# EasyEDA Pro project 装甲板（击打反馈）v1.1.epro

# Schematic Schematic2
Board Name: Board2; Create Date: 2025-01-13
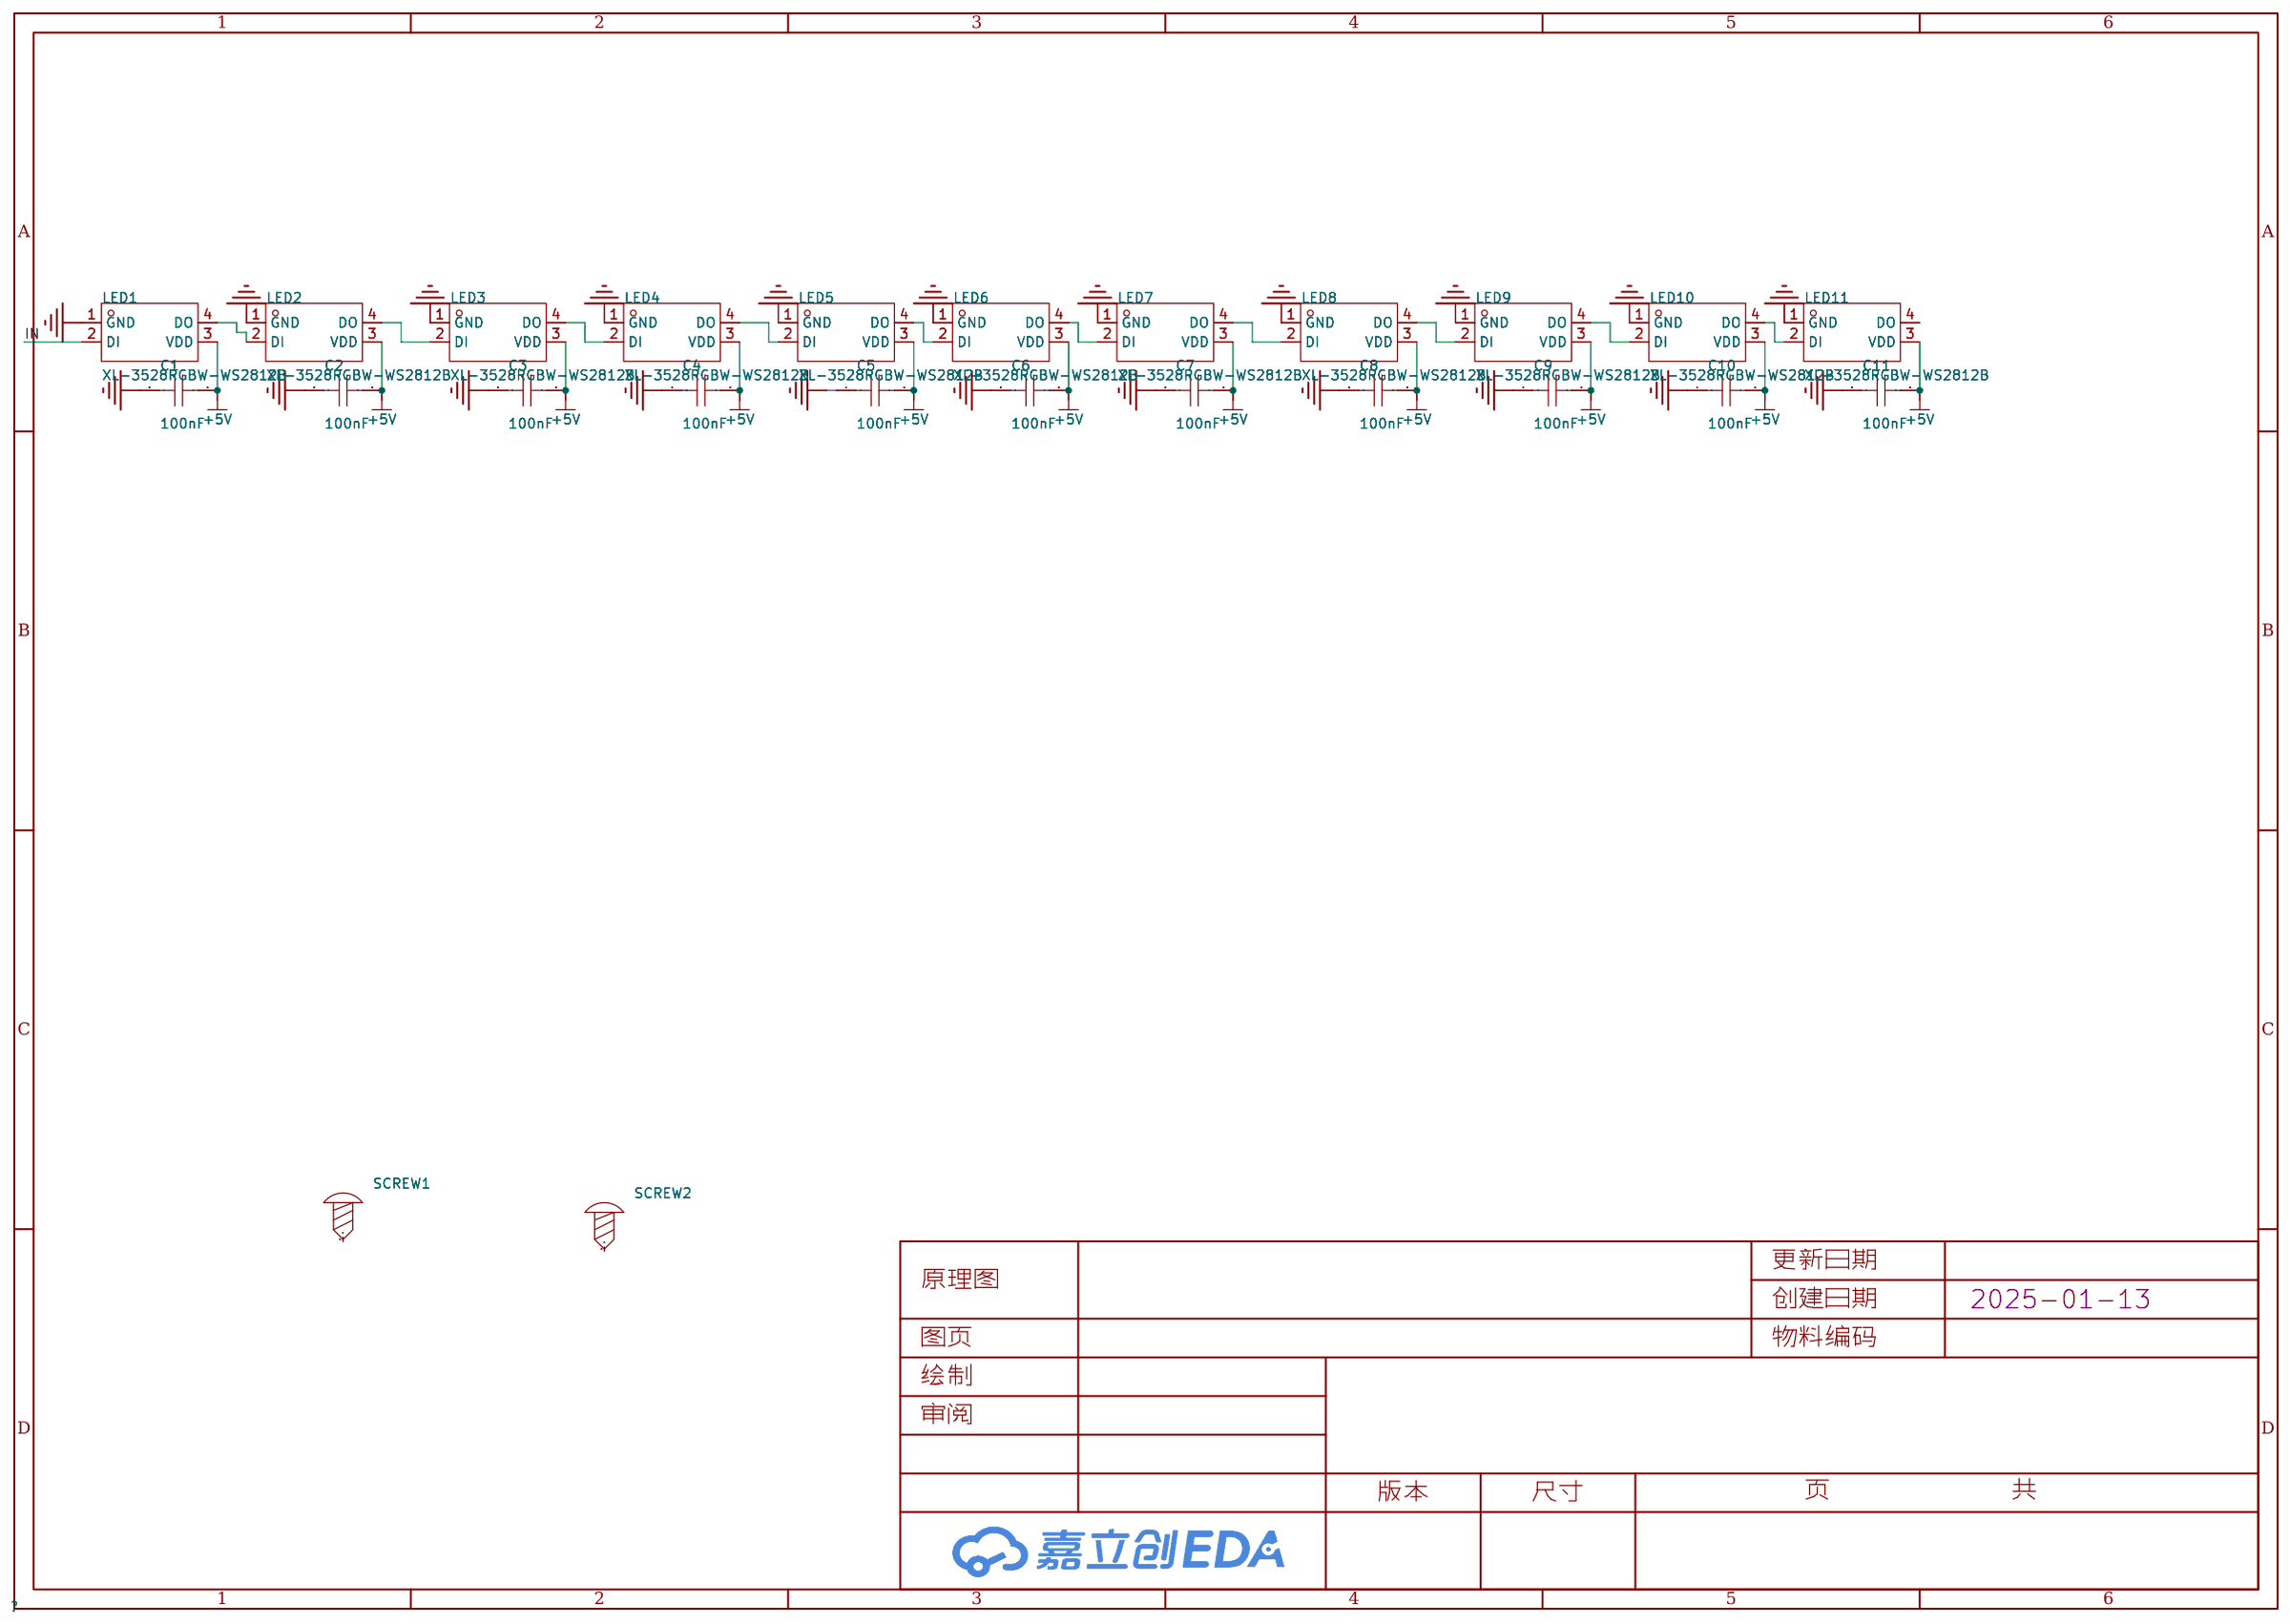
[diagram p0: schematic sheet]

## Parts
C1  100nF  [C0603]
C2  100nF  [C0603]
C3  100nF  [C0603]
C4  100nF  [C0603]
C5  100nF  [C0603]
C6  100nF  [C0603]
C7  100nF  [C0603]
C8  100nF  [C0603]
C9  100nF  [C0603]
C10  100nF  [C0603]
C11  100nF  [C0603]
LED1  XL-3528RGBW-WS2812B  [LED-SMD_4P-L3.5-W2.8-BR-1]
LED2  XL-3528RGBW-WS2812B  [LED-SMD_4P-L3.5-W2.8-BR-1]
LED3  XL-3528RGBW-WS2812B  [LED-SMD_4P-L3.5-W2.8-BR-1]
LED4  XL-3528RGBW-WS2812B  [LED-SMD_4P-L3.5-W2.8-BR-1]
LED5  XL-3528RGBW-WS2812B  [LED-SMD_4P-L3.5-W2.8-BR-1]
LED6  XL-3528RGBW-WS2812B  [LED-SMD_4P-L3.5-W2.8-BR-1]
LED7  XL-3528RGBW-WS2812B  [LED-SMD_4P-L3.5-W2.8-BR-1]
LED8  XL-3528RGBW-WS2812B  [LED-SMD_4P-L3.5-W2.8-BR-1]
LED9  XL-3528RGBW-WS2812B  [LED-SMD_4P-L3.5-W2.8-BR-1]
LED10  XL-3528RGBW-WS2812B  [LED-SMD_4P-L3.5-W2.8-BR-1]
LED11  XL-3528RGBW-WS2812B  [LED-SMD_4P-L3.5-W2.8-BR-1]
SCREW1  -  [M2螺丝]
SCREW2  -  [M2螺丝]

## Library data of the parts
C1-C11 = CAP_0603: Supplier Footprint: 0603
LED1-LED11 = XL-3528RGBW-WS2812B: 3528 七彩幻彩雾状 ws2812B 内置驱动IC; Supplier Part: C2890364; Manufacturer: XINGLIGHT(成兴光); Supplier Footprint: SMD3528-4P; JLCPCB Part Class: 扩展库; Datasheet: https://atta.szlcsc.com/upload/public/pdf/source/20240218/041E1E0D0024617DFFF124D9C311BB4D.pdf; Supplier: LCSC
SCREW1 SCREW2 = M2螺丝: Supplier Footprint: 插件

## Nets
+5V: C1.2 C2.2 C3.2 C4.2 C5.2 C6.2 C7.2 C8.2 C9.2 C10.2 C11.2 LED1.3(VDD) LED2.3(VDD) LED3.3(VDD) LED4.3(VDD) LED5.3(VDD) LED6.3(VDD) LED7.3(VDD) LED8.3(VDD) LED9.3(VDD) LED10.3(VDD) LED11.3(VDD)
GND: C1.1 C2.1 C3.1 C4.1 C5.1 C6.1 C7.1 C8.1 C9.1 C10.1 C11.1 LED1.1(GND) LED2.1(GND) LED3.1(GND) LED4.1(GND) LED5.1(GND) LED6.1(GND) LED7.1(GND) LED8.1(GND) LED9.1(GND) LED10.1(GND) LED11.1(GND)
IN: LED1.2(DI)
$1N1586: LED1.4(DO) LED2.2(DI)
$1N1594: LED2.4(DO) LED3.2(DI)
$1N1600: LED3.4(DO) LED4.2(DI)
$1N1610: LED4.4(DO) LED5.2(DI)
$1N1617: LED5.4(DO) LED6.2(DI)
$1N1624: LED6.4(DO) LED7.2(DI)
$1N1631: LED7.4(DO) LED8.2(DI)
$1N1638: LED8.4(DO) LED9.2(DI)
$1N1645: LED9.4(DO) LED10.2(DI)
$1N1652: LED10.4(DO) LED11.2(DI)

Not connected (* = marked no-connect by the designer): LED11 4(DO); SCREW1 1; SCREW2 1

# Schematic Schematic1
Board Name: Board1; Create Date: 2025-01-13
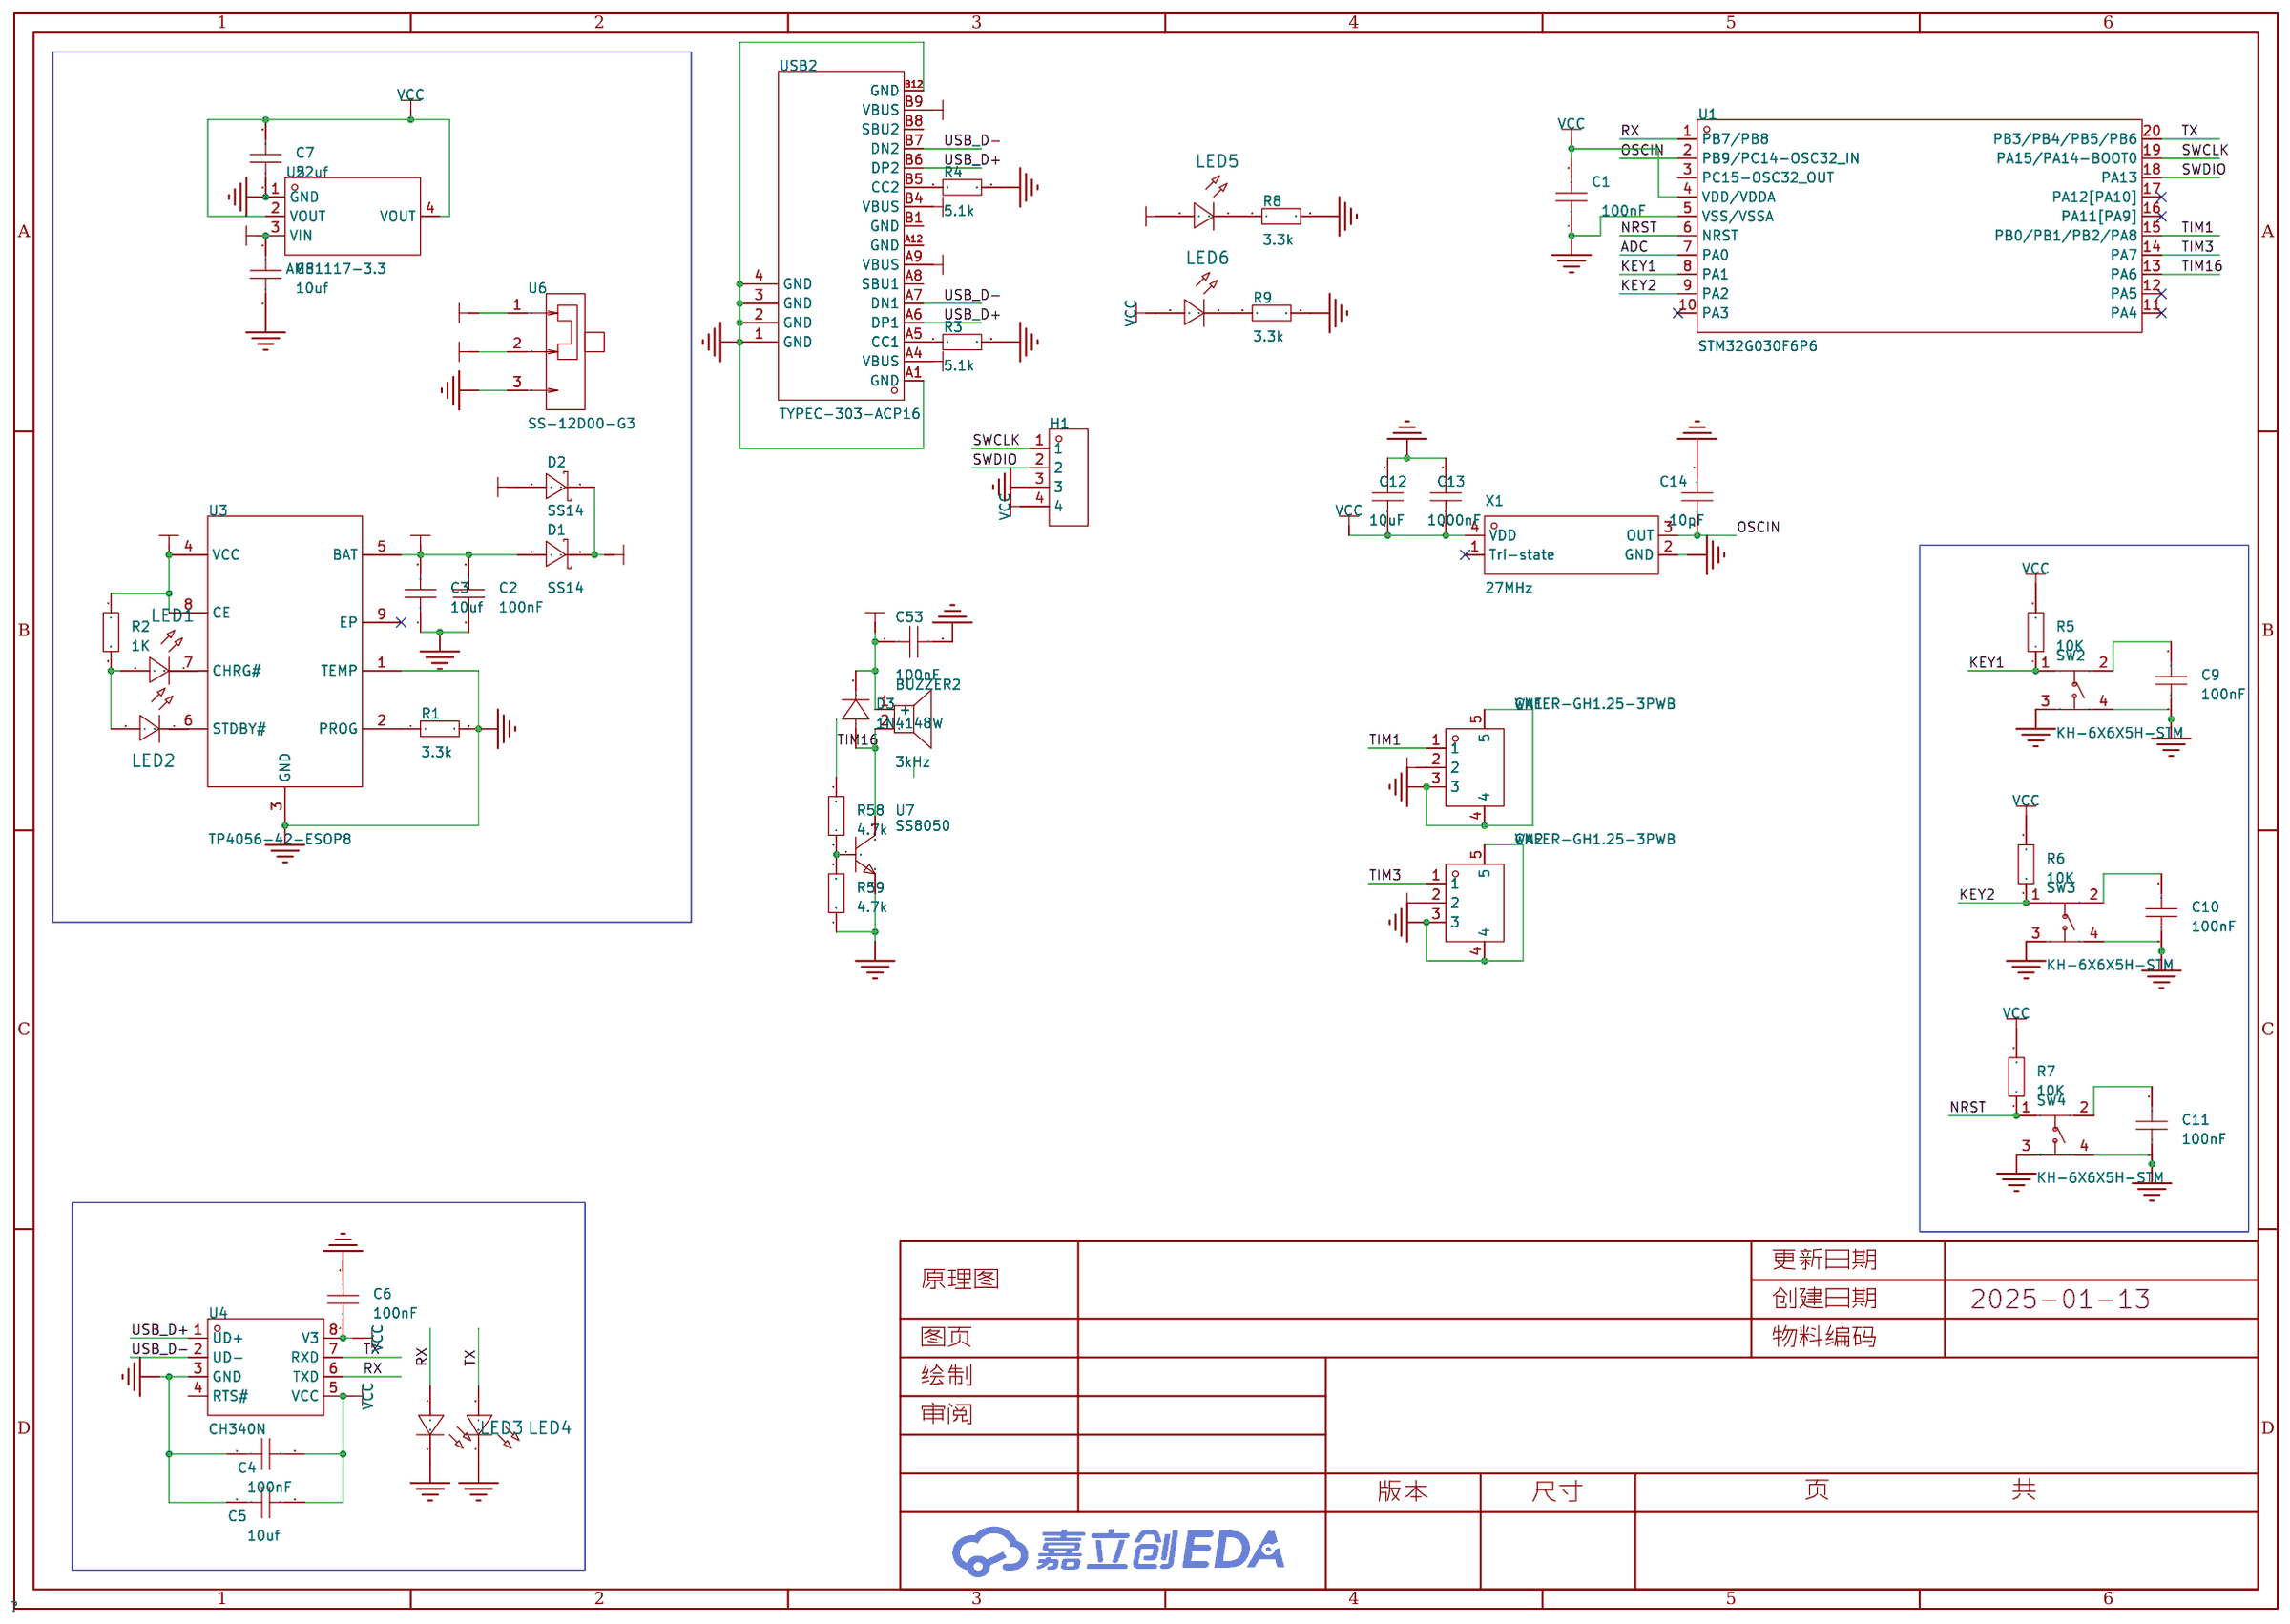
[diagram p1: schematic sheet]

## Parts
BUZZER2  3kHz  [BUZ-TH_BD9.6-P5.00-D0.7-FD]
C1  100nF  [C0603]
C2  100nF  [C0603]
C3  10uf  [C0603]
C4  100nF  [C0603]
C5  10uf  [C0603]
C6  100nF  [C0603]
C7  22uf  [C0603]
C8  10uf  [C0603]
C9  100nF  [C0603]
C10  100nF  [C0603]
C11  100nF  [C0603]
C12  10uF  [C0603]
C13  1000nF  [C0603]
C14  10pF  [C0603]
C53  100nF  [C0603]
CN1  WAFER-GH1.25-3PWB  [CONN-TH_3P-P1.25_GH1.25]
CN2  WAFER-GH1.25-3PWB  [CONN-TH_3P-P1.25_GH1.25]
D1  SS14  [SMA_L4.2-W2.6-LS5.3-RD]
D2  SS14  [SMA_L4.2-W2.6-LS5.3-RD]
D3  1N4148W  [SOD-123_L3.1-W1.7-LS3.7-RD]
H1  -  [HDR-TH_4P-P2.54-V-M]
LED1  -  [LED_0603]
LED2  -  [LED_0603]
LED3  -  [LED_0603]
LED4  -  [LED_0603]
LED5  -  [LED_0603]
LED6  -  [LED_0603]
R1  3.3k  [R0603]
R2  1K  [R0603]
R3  5.1k  [R0603]
R4  5.1k  [R0603]
R5  10K  [R0603]
R6  10K  [R0603]
R7  10K  [R0603]
R8  3.3k  [R0603]
R9  3.3k  [R0603]
R58  4.7k  [R0603]
R59  4.7k  [R0603]
SW2  KH-6X6X5H-STM  [SW-SMD_4P-L6.0-W6.0-P4.50-LS9.0-2]
SW3  KH-6X6X5H-STM  [SW-SMD_4P-L6.0-W6.0-P4.50-LS9.0-2]
SW4  KH-6X6X5H-STM  [SW-SMD_4P-L6.0-W6.0-P4.50-LS9.0-2]
U1  STM32G030F6P6  [TSSOP-20_L6.5-W4.4-P0.65-LS6.4-BL]
U3  TP4056-42-ESOP8  [ESOP-8_L4.9-W3.9-P1.27-LS6.0-BL-EP]
U4  CH340N  [SOP-8_L4.9-W3.9-P1.27-LS6.0-BL]
U5  AMS1117-3.3  [SOT-223-3_L6.5-W3.4-P2.30-LS7.0-BR]
U6  SS-12D00-G3  [SW-TH_3P-L8.8-W3.9-P2.50_SS12D00G3]
U7  SS8050  [SOT-23-3_L2.9-W1.3-P1.90-LS2.4-BR]
USB2  TYPEC-303-ACP16  [USB-C-SMD_TYPEC-303-ACP16]
X1  27MHz  [OSC-SMD_4P-L3.2-W2.5-BL]

## Library data of the parts
BUZZER2 = HNB09A05: 驱动方式:有源(内含驱动线路);构造类型:电磁式;频率:3kHz;声压(SPL):85dB;; Supplier Part: C96493; Manufacturer: 华能; Supplier Footprint: 插件,D=9mm; JLCPCB Part Class: 扩展库; Datasheet: https://atta.szlcsc.com/upload/public/pdf/source/20170522/1495448327549.pdf; Supplier: LCSC; Oscillator Circuit: 有源(内含驱动线路); Technology Type: 电磁式; Operating Voltage: 4V~8V; Sound Pressure Level (SPL): 85dB; Diameter (φD): 9mm; Height: 5.7mm
C1-C14 C53 = CAP_0603: Supplier Footprint: 0603
CN1 CN2 = WAFER-GH1.25-3PWB: 插针结构:1x3P;间距:1.25mm;安装方式:卧贴;参考系列:GH;总PIN数:3P;排数:1;每排PIN数:3;额定电流:1A;工作温度范围:-25℃~+85℃;; LCSC Part Name: 1x3P 间距:1.25mm 卧贴 系列:GH; Supplier Part: C3029378; Manufacturer: XUNPU(讯普); Supplier Footprint: SMD,P=1.25mm,卧贴; JLCPCB Part Class: 扩展库; Datasheet: https://atta.szlcsc.com/upload/public/pdf/source/20220527/CB8773BFB0913C3B8ABD62CB38BA101A.pdf; Supplier: LCSC; Pins Structure: 1x3P; Pitch: 1.25mm; Mounting Style: 卧贴; Reference Series: GH; Number of Pins: 3P; Number of Rows: 1; Number of PINs Per Row: 3; Current Rating (Max): 1A; Operating Temperature Range: -25℃~+85℃
D1 D2 = SS14_C2480: 二极管配置:独立式;正向压降(Vf):550mV@1A;直流反向耐压(Vr):40V;整流电流:1A;; LCSC Part Name: 电压:40V 电流:1A; Supplier Part: C2480; Manufacturer: MDD(辰达半导体); Supplier Footprint: SMA(DO-214AC); JLCPCB Part Class: 基础库; Datasheet: https://atta.szlcsc.com/upload/public/pdf/source/20230712/2DB6064CFBB99DE6DB116BEE8208BE66.pdf; Supplier: LCSC; Diode Configuration: 独立式; Forward Voltage (Vf@If): 550mV@1A; Reverse Voltage (Vr): 40V; Rectified Current: 1A; Reverse Leakage Current (Ir): 300uA@40V
D3 = 1N4148W_C727110: 二极管配置:独立式;正向压降(Vf):1.5V@300mA;直流反向耐压(Vr):100V;平均整流电流(Io):300mA;功率:400mW;反向恢复时间(trr):8ns;; LCSC Part Name: 电压:100V 电流:300mA; Supplier Part: C727110; Manufacturer: TWGMC(台湾迪嘉); Supplier Footprint: SOD-123; JLCPCB Part Class: Extended Part; Datasheet: https://atta.szlcsc.com/upload/public/pdf/source/20200828/C727110_99AC3443E5714B605FD2E8FDF6DB8A39.pdf; Supplier: LCSC; Diode Configuration: 独立式; Forward Voltage (Vf@If): 1.5V@300mA; Reverse Voltage (Vr): 100V; Average Rectified Current (Io): 300mA; Power Dissipation: 400mW; Reverse Leakage Current: 1uA@75V; Reverse Recovery Time (trr): 8ns; Operating Temperature: -55℃~+150℃@(Tj)
H1 = HDR-M_2.54_1x4P: Supplier Part: C492403; Supplier Footprint: 插件
LED1-LED6 = LED_0603-R: Supplier Footprint: 0603
R1-R9 R58 R59 = Res_0603: Supplier Footprint: 0603
SW2-SW4 = KH-6X6X5H-STM: 电路结构:单刀单掷;按钮形状:圆形按钮;安装方式:立贴;开关长度:6mm;开关宽度:6mm;开关高度:5mm;带支架:不带;触点电流:50mA;额定电压(DC):12V;机械寿命:8万次;; LCSC Part Name: 6*6*5mm 立贴 轻触开关; Supplier Part: C2837531; Manufacturer: kinghelm(金航标); Supplier Footprint: SMD; JLCPCB Part Class: 扩展库; Datasheet: https://atta.szlcsc.com/upload/public/pdf/source/20210608/C2837531_45E87AB996CE723B09405FF2EA209C4C.pdf; Supplier: LCSC; Circuit: 单刀单掷; Actuator Style: 圆形按钮; Mounting Style: 立贴; Switch Length: 6mm; Switch Width: 6mm; Switch Height: 5mm; Strike Gundam: 不带; Contact Current: 50mA; Voltage Rating (DC): 12V; Actuator/Cap Color: 黑色; Pin Style: 鸥翼型; Mechanical Life: 8万次
U1 = STM32G030F6P6: CPU内核:ARM-M0;CPU最大主频:64MHz;应用领域:-;; LCSC Part Name: 主流超值系列Arm Cortex-M0+ MCU，具有32 KB Flash存储器、8 KB RAM、64 MHz CPU、2x USART、定时器、ADC和通信接口，2-3.6V; Supplier Part: C724040; Manufacturer: ST(意法半导体); Supplier Footprint: TSSOP-20; JLCPCB Part Class: 扩展库; Datasheet: https://atta.szlcsc.com/upload/public/pdf/source/20200511/C529329_A1CB615556C746C4EA827FCAD1461480.pdf; Supplier: LCSC; CPU Core: ARM-M0; CPU Maximum Speed: 64MHz; Program Storage Size: 32KB; Program Memory Type: FLASH; Number of I/O: 18; ADC (Bit): 12bit; Low Voltage Detection Threshold: 2V~3.6V
U3 = TP4056-42-ESOP8: 锂电池充电芯片 42代表电池满电电压4.2V。; Supplier Part: C16581; Manufacturer: TOPPOWER(南京拓微); Supplier Footprint: ESOP-8; JLCPCB Part Class: 扩展库; Datasheet: https://atta.szlcsc.com/upload/public/pdf/source/20190626/C16581_611BCF5D7CF554EAE465137A8F68DB3E.pdf; Supplier: LCSC
U4 = CH340N: 应用功能:USB转串口;接口协议:USB 2.0;通道数:1;数据速率:2Mbps;; LCSC Part Name: USB转串口芯片CH340; Supplier Part: C2977777; Manufacturer: WCH(南京沁恒); Supplier Footprint: SOP-8; JLCPCB Part Class: 扩展库; Datasheet: https://atta.szlcsc.com/upload/public/pdf/source/20240313/115CDE92081B1D6CB446704AD5D0F5F2.pdf; Supplier: LCSC; Applications Function: USB转串口; Protocol: USB 2.0; Number of Channels: 1; Supply Voltage: 3.3V；5V; Data Rate: 2Mbps; Operating Temperature: -20℃~+70℃
U5 = AMS1117-3.3_C6186: 输出类型:固定;最大输入电压:-;输出电压:3.3V;最大输出电流:1A;电源纹波抑制比(PSRR):72dB@(120Hz);输出极性:正极;; LCSC Part Name: 输出3.3V 1A; Supplier Part: C6186; Manufacturer: AMS; Supplier Footprint: SOT-223; JLCPCB Part Class: 基础库; Datasheet: https://atta.szlcsc.com/upload/public/pdf/source/20180727/C6186_7A095716F0823C02F1997A905E26C086.pdf; Supplier: LCSC; Output Type: 固定; Output Voltage: 3.3V; MAX Output Current: 1A; Power Supply Rejection Ratio (PSRR): 72dB@(120Hz); Dropout Voltage: 1.3V@(800mA); Output Polarity: 正极; Number of Outputs: 1
U6 = SS-12D00-G3: 操作正拨 插件立式 尺寸大型 两档位; Supplier Part: C22355741; Manufacturer: SOFNG(硕方); Supplier Footprint: 插件-3P,8.8x3.9mm; JLCPCB Part Class: 扩展库; Datasheet: https://atta.szlcsc.com/upload/public/pdf/source/20240529/1037A069FE9BBCECE56007AB916D4384.pdf; Supplier: LCSC
U7 = SS8050_C7420370: 晶体管类型:NPN;集电极电流(Ic):1.5A;集射极击穿电压(Vceo):25V;功率(Pd):300mW;直流电流增益(hFE@Ic,Vce):120@100mA,1.0V;; LCSC Part Name: 耐压:25V 电流:1.5A NPN H档 200-350; Supplier Part: C7420370; Manufacturer: 宏迦橙; Supplier Footprint: SOT-23; JLCPCB Part Class: 扩展库; Datasheet: https://atta.szlcsc.com/upload/public/pdf/source/20231222/9C4050A7669EB24B3ACD0418218817FD.pdf; Supplier: LCSC; Transistor Type: NPN; Collector Current (Ic): 1.5A; Collector-Emitter Breakdown Voltage (Vceo): 25V; Power Dissipation (Pd): 300mW; DC Current Gain (hFE@Ic,Vce): 120@100mA,1.0V; Transition Frequency (fT): 100MHz; Collector Cut-Off Current (Icbo): 100nA; Collector-Emitter Saturation Voltage (VCE(sat)@Ic,Ib): 500mV@800mA,80mA; Operating Temperature: -55℃~+150℃
USB2 = TYPEC-303-ACP16: 连接器类型:Type-C;标准:USB 3.1;公母:母;端口数量:1;触点数量:16P;安装方式:立贴;额定电流 - 电源:5A;工作温度范围:-25℃~+85℃;焊接温度(最大值):260℃;; LCSC Part Name: Type-C 母 立贴; Supplier Part: C720628; Manufacturer: XUNPU(讯普); Supplier Footprint: SMD; JLCPCB Part Class: 扩展库; Datasheet: https://atta.szlcsc.com/upload/public/pdf/source/20211130/923863AA03137020414D5B2211B6B11A.pdf; Supplier: LCSC; Connector Type: Type-C; Standard: USB 3.1; Gender: 母; Number of Ports: 1; Number of Contacts: 16P; Mounting Style: 立贴; Current Rating - Power (Max): 5A; Operating Temperature Range: -25℃~+85℃; Soldering Temperature(Max): 260℃
X1 = OT2EL4C4JI-111OLP-27M: 频率:27MHz;常温频差:±10ppm;输出模式:CMOS;工作电压:1.8V~3.3V;; LCSC Part Name: 27MHZ 1.8V-3.3V ±10PPM YSO110TR; Supplier Part: C5203549; Manufacturer: YXC(扬兴晶振); Supplier Footprint: SMD3225-4P; JLCPCB Part Class: 扩展库; Datasheet: https://atta.szlcsc.com/upload/public/pdf/source/20221021/93BE0275F36E6561B802C10A6737F13A.pdf; Supplier: LCSC; Normal temperature Frequency Tolerance: ±10ppm; Output Type: CMOS; Supply Voltage: 1.8V~3.3V; Operating Temperature: -40℃~+85℃

## Nets
GND: C1.1 C2.1 C3.1 C4.1 C5.1 C6.2 C7.1 C8.1 C9.1 C10.1 C11.1 C12.2 C13.2 C14.2 C53.2 CN1.3 CN1.4 CN1.5 CN2.3 CN2.4 CN2.5 H1.3 LED3.1(C) LED4.1(C) R1.2 R3.2 R4.2 R8.2 R9.2 R59.1 SW2.3 SW2.4 SW3.3 SW3.4 SW4.3 SW4.4 U1.5(VSS/VSSA) U3.1(TEMP) U3.3(GND) U4.3(GND) U5.1(GND) U6.3 U7.2(E) USB2.1(GND) USB2.2(GND) USB2.3(GND) USB2.4(GND) USB2.A1(GND) USB2.B12(GND) X1.2(GND)
VBUS: BUZZER2.1(+) C53.1 CN1.2 CN2.2 D2.2(A) D3.1(K) LED5.2(A) R2.1 U3.4(VCC) U3.8(CE) USB2.A4(VBUS) USB2.A9(VBUS) USB2.B4(VBUS) USB2.B9(VBUS)
VCC: C1.2 C4.2 C5.2 C6.1 C7.2 C12.1 C13.1 H1.4 LED6.2(A) R5.2 R6.2 R7.2 U1.4(VDD/VDDA) U4.5(VCC) U4.8(V3) U5.2(VOUT) U5.4(VOUT) X1.4(VDD)
VIN: C8.2 U5.3(VIN) U6.2
ADC: U1.7(PA0)
BAT: C2.2 C3.2 D1.2(A) U3.5(BAT)
KEY1: R5.1 SW2.1 U1.8(PA1)
KEY2: R6.1 SW3.1 U1.9(PA2)
NRST: R7.1 SW4.1 U1.6(NRST)
OSCIN: C14.1 U1.2(PB9/PC14-OSC32_IN) X1.3(OUT)
RX: LED3.2(A) U1.1(PB7/PB8) U4.6(TXD)
SWCLK: H1.1 U1.19(PA15/PA14-BOOT0)
SWDIO: H1.2 U1.18(PA13)
TIM1: CN1.1 U1.15(PB0/PB1/PB2/PA8)
TIM3: CN2.1 U1.14(PA7)
TIM16: R58.2 U1.13(PA6)
TX: LED4.2(A) U1.20(PB3/PB4/PB5/PB6) U4.7(RXD)
USB_D+: U4.1(UD+) USB2.A6(DP1) USB2.B6(DP2)
USB_D-: U4.2(UD-) USB2.A7(DN1) USB2.B7(DN2)
VOUT: D1.1(K) D2.1(K) U6.1
$1N907: R1.1 U3.2(PROG)
$1N910: LED1.2(A) LED2.2(A) R2.2
$1N911: LED1.1(C) U3.7(CHRG#)
$1N912: LED2.1(C) U3.6(STDBY#)
$1N1730: R3.1 USB2.A5(CC1)
$1N1756: R4.1 USB2.B5(CC2)
$1N2680: C9.2 SW2.2
$1N2872: C10.2 SW3.2
$1N3022: C11.2 SW4.2
$1N3734: LED5.1(C) R8.1
$1N3739: LED6.1(C) R9.1
$1N5447: R58.1 R59.2 U7.1(B)
$1N5448: BUZZER2.2 D3.2(A) U7.3(C)

Not connected (* = marked no-connect by the designer): U1 3(PC15-OSC32_OUT) 10(PA3)* 11(PA4)* 12(PA5)* 16(PA11[PA9])* 17(PA12[PA10])*; U3 9(EP)*; U4 4(RTS#); USB2 A8(SBU1) A12(GND) B1(GND) B8(SBU2); X1 1(Tri-state)*

# Board PCB2
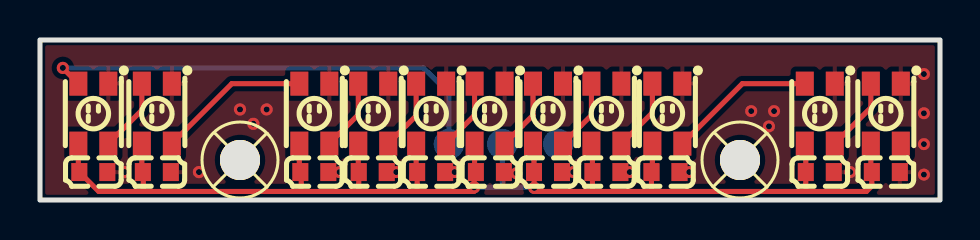
[diagram p2: board, top side]
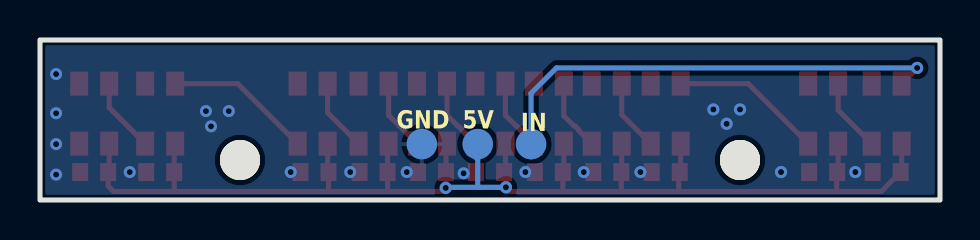
[diagram p3: board, bottom side, seen from below]

Outline 45 x 8 mm; copper layers: Top Layer, Bottom Layer. Coordinates in mm from the lower left corner of the outline.
Outline path: rectangle 0,8 45,0
Stack: Top Layer 0.035mm / Dielectric1 1.51mm FR4 er 4.5 / Bottom Layer 0.035mm

## Design rules (mm)
template: 自定义配置
spacing copperThickness1oz (default): track to track 0.102, other pairs 0.152 to 0.3
spacing copperThickness2oz: track to track 0.203, other pairs 0.152 to 0.3
track width copperThickness1oz (default): min 0.127, default 0.254, max 2.54
track width copperThickness2oz: min 0.203, default 0.254, max 2.54
differential pair differentialPair (default): width min 0.127, default 0.254, max 2.54; gap min 0.152, default 0.152
via viaSize (default): diameter min 0.5, default 0.6, max 10; hole min 0.3, default 0.3, max 6.3

## Placement (name value [footprint] x y rotation side)
C1  100nF  [C0603]  2.67 1.4 180 top
C2  100nF  [C0603]  5.84 1.4 180 top
C3  100nF  [C0603]  13.72 1.4 180 top
C4  100nF  [C0603]  16.64 1.4 180 top
C5  100nF  [C0603]  19.56 1.4 180 top
C6  100nF  [C0603]  22.5 1.4 180 top
C7  100nF  [C0603]  28.32 1.4 180 top
C8  100nF  [C0603]  25.4 1.4 180 top
C9  100nF  [C0603]  31.27 1.4 180 top
C10  100nF  [C0603]  38.99 1.4 180 top
C11  100nF  [C0603]  42.29 1.4 180 top
LED1  XL-3528RGBW-WS2812B  [LED-SMD_4P-L3.5-W2.8-BR-1]  2.67 4.32 90 top
LED2  XL-3528RGBW-WS2812B  [LED-SMD_4P-L3.5-W2.8-BR-1]  5.84 4.32 90 top
LED3  XL-3528RGBW-WS2812B  [LED-SMD_4P-L3.5-W2.8-BR-1]  13.72 4.32 90 top
LED4  XL-3528RGBW-WS2812B  [LED-SMD_4P-L3.5-W2.8-BR-1]  16.66 4.32 90 top
LED5  XL-3528RGBW-WS2812B  [LED-SMD_4P-L3.5-W2.8-BR-1]  19.56 4.32 90 top
LED6  XL-3528RGBW-WS2812B  [LED-SMD_4P-L3.5-W2.8-BR-1]  22.48 4.32 90 top
LED7  XL-3528RGBW-WS2812B  [LED-SMD_4P-L3.5-W2.8-BR-1]  25.4 4.32 90 top
LED8  XL-3528RGBW-WS2812B  [LED-SMD_4P-L3.5-W2.8-BR-1]  28.32 4.32 90 top
LED9  XL-3528RGBW-WS2812B  [LED-SMD_4P-L3.5-W2.8-BR-1]  31.37 4.32 90 top
LED10  XL-3528RGBW-WS2812B  [LED-SMD_4P-L3.5-W2.8-BR-1]  38.99 4.32 90 top
LED11  XL-3528RGBW-WS2812B  [LED-SMD_4P-L3.5-W2.8-BR-1]  42.29 4.32 90 top
NOREF  -  [Pad_e26]  20.45 2.79 180 top
NOREF#2  -  [Pad_e1]  23.11 2.79 180 top
NOREF#3  -  [Pad_e27]  25.91 2.79 180 top
SCREW1  -  [M2螺丝]  10 2 0 top
SCREW2  -  [M2螺丝]  35 2 0 top

## Footprints (pads in the part's own frame, mm; a bottom-side part is the same pattern mirrored in y, then rotated)
C0603
  rect 0.8x0.9 smd: 1(-0.7,0) 2(0.7,0)
LED-SMD_4P-L3.5-W2.8-BR-1
  rect 1.2x0.9 smd: 1(1.5,-0.75) 2(1.5,0.75) 3(-1.5,0.75) 4(-1.5,-0.75)
M2螺丝
  round 2 hole 2: 1(0,0)
Pad_e1
  round 1.524 smd far side: 1(0,0)
Pad_e26
  round 1.524 smd far side: 2(0,0)
Pad_e27
  round 1.524 smd far side: 3(0,0)

## Nets
+5V: C1.2 C2.2 C3.2 C4.2 C5.2 C6.2 C7.2 C8.2 C9.2 C10.2 C11.2 LED1.3 LED2.3 LED3.3 LED4.3 LED5.3 LED6.3 LED7.3 LED8.3 LED9.3 LED10.3 LED11.3 NOREF#2.1
GND: C1.1 C2.1 C3.1 C4.1 C5.1 C6.1 C7.1 C8.1 C9.1 C10.1 C11.1 LED1.1 LED2.1 LED3.1 LED4.1 LED5.1 LED6.1 LED7.1 LED8.1 LED9.1 LED10.1 LED11.1 NOREF#3.3
IN: LED1.2 NOREF.2
$1N1586: LED1.4 LED2.2
$1N1594: LED2.4 LED3.2
$1N1600: LED3.4 LED4.2
$1N1610: LED4.4 LED5.2
$1N1617: LED5.4 LED6.2
$1N1624: LED6.4 LED7.2
$1N1631: LED7.4 LED8.2
$1N1638: LED8.4 LED9.2
$1N1645: LED9.4 LED10.2
$1N1652: LED10.4 LED11.2

Pads without a net: LED11 4; SCREW1 1; SCREW2 1

## Via types
v1: diameter 0.61, hole 0.305, Top Layer to Bottom Layer, 8 vias
v2: diameter 0.6, hole 0.3, Top Layer to Bottom Layer, 15 vias

## Routing (per net, layer and track width the routed paths; a pad name or vN(x,y) marks a point on that pad's centre or on a via; arc(x,y) is an arc through that point)
+5V: length 66.9
  Top Layer w0.254: 5.16,0.43 2.94,0.43 C1.2 1.92,1.45 LED1.3 ; 5.16,0.43 13.06,0.43 ; 5.16,0.43 5.16,1.37 C2.2 5.09,1.45 LED2.3 ; LED5.3 18.81,1.45 C5.2 18.86,0.48 18.81,0.43 ; 27.67,0.43 24.71,0.43 24.71,1.39 C8.2 24.7,2.77 LED7.3 ; 27.67,0.43 27.62,0.48 C7.2 27.62,2.77 LED8.3 ; 27.67,0.43 30.5,0.43 ; C9.2 30.57,0.5 30.5,0.43 ; 13.06,0.43 15.85,0.43 ; 13.06,0.43 13.06,1.35 C3.2 12.97,1.45 LED3.3 ; 15.85,0.43 15.94,0.51 C4.2 15.91,1.42 LED4.3 ; 15.85,0.43 18.81,0.43 ; LED10.3 38.29,2.77 38.29,0.46 38.32,0.43 ; 30.5,0.43 38.32,0.43 ; LED11.3 41.54,1.45 C11.2 41.59,0.7 41.32,0.43 38.32,0.43 ; LED9.3 30.62,1.57 ; 18.81,0.43 21.71,0.43 ; 30.51,1.46 30.45,1.4 ; v1(21.71,0.64) 21.71,1.31 C6.2 21.73,1.46 LED6.3
  Bottom Layer w0.254: 23.11,0.64 23.11,2.03 23.24,2.16 ; 23.11,0.64 24.69,0.64 v1(24.72,0.61) ; 23.11,0.64 v1(21.71,0.64)
GND:
  vias: v1(4.23,1.4) v1(7.95,1.4) v1(10,4.53) v1(10.67,3.81) v1(11.33,4.53) v2(14.98,1.4) v2(17.81,1.4) v2(20.73,1.4) v2(23.82,1.34) v2(26.66,1.4) v2(29.49,1.4) v2(32.47,1.4) v2(35.56,4.44) v2(36.45,3.68) v2(36.7,4.44) v2(40.51,1.4) v2(44.2,6.3) v2(44.2,4.34) v2(44.2,2.79) v2(44.2,1.27)
IN: length 24.1
  Top Layer w0.254: LED1.2 1.14,6.59 v1(1.14,6.6)
  Bottom Layer w0.254: v1(1.14,6.6) 19.18,6.6 20.45,5.33 NOREF.2 20.45,2.16
$1N1586: length 3.7
  Top Layer w0.254: LED1.4 5.09,4.49 LED2.2
$1N1594: length 7.6
  Top Layer w0.254: LED3.2 9.59,5.82 LED2.4
$1N1600: length 3.6
  Top Layer w0.254: LED4.2 15.91,4.27 LED3.4
$1N1610: length 3.6
  Top Layer w0.254: LED4.4 18.08,3.48 18.08,3.53 18.24,3.7 18.29,3.7 18.81,4.21 LED5.2
$1N1617: length 3.6
  Top Layer w0.254: LED5.4 21,3.51 21,3.53 21.16,3.7 21.19,3.7 21.73,4.24 LED6.2
$1N1624: length 3.6
  Top Layer w0.254: LED6.4 23.92,3.51 23.92,3.53 24.08,3.7 24.11,3.7 24.65,4.24 LED7.2
$1N1631: length 3.6
  Top Layer w0.254: LED8.2 27.57,4.24 27.03,3.7 27.01,3.7 26.84,3.53 26.84,3.51 LED7.4
$1N1638: length 3.6
  Top Layer w0.254: LED8.4 30.62,4.37 LED9.2
$1N1645: length 7.4
  Top Layer w0.254: LED10.2 35.12,5.82 LED9.4
$1N1652: length 3.7
  Top Layer w0.254: LED10.4 41.54,4.62 LED11.2

## Copper pours and planes (outline as drawn; the poured copper is in the pictures)
GND on Top Layer: -4.32,10.41 50.8,10.41 50.8,-0.89 -4.32,-0.89
GND on Bottom Layer: -1.52,10.03 47.37,10.03 47.37,-3.94 -1.52,-3.94

## Text on the board
Bottom Silkscreen Layer: IN | 5V | GND

# Board PCB1
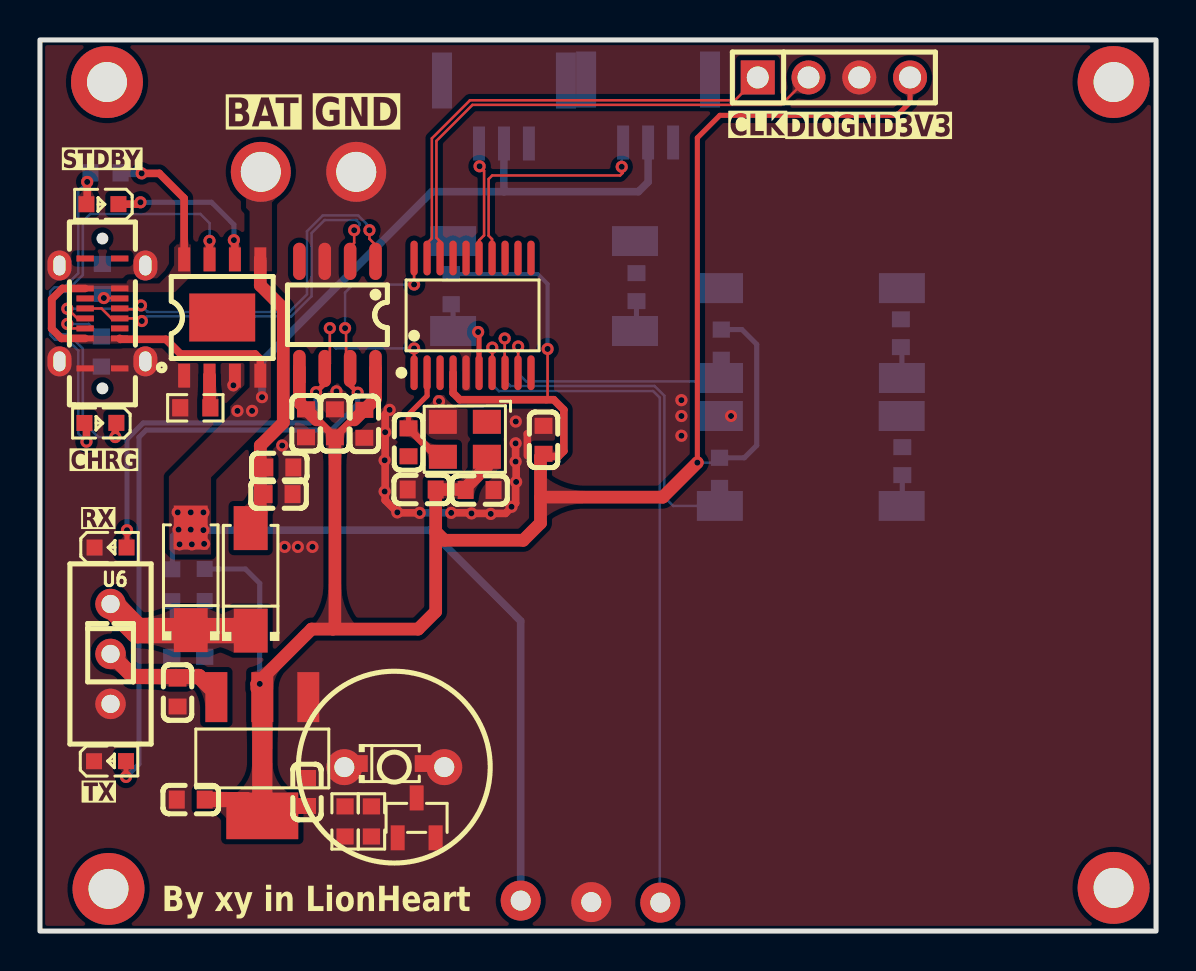
[diagram p4: board, top side]
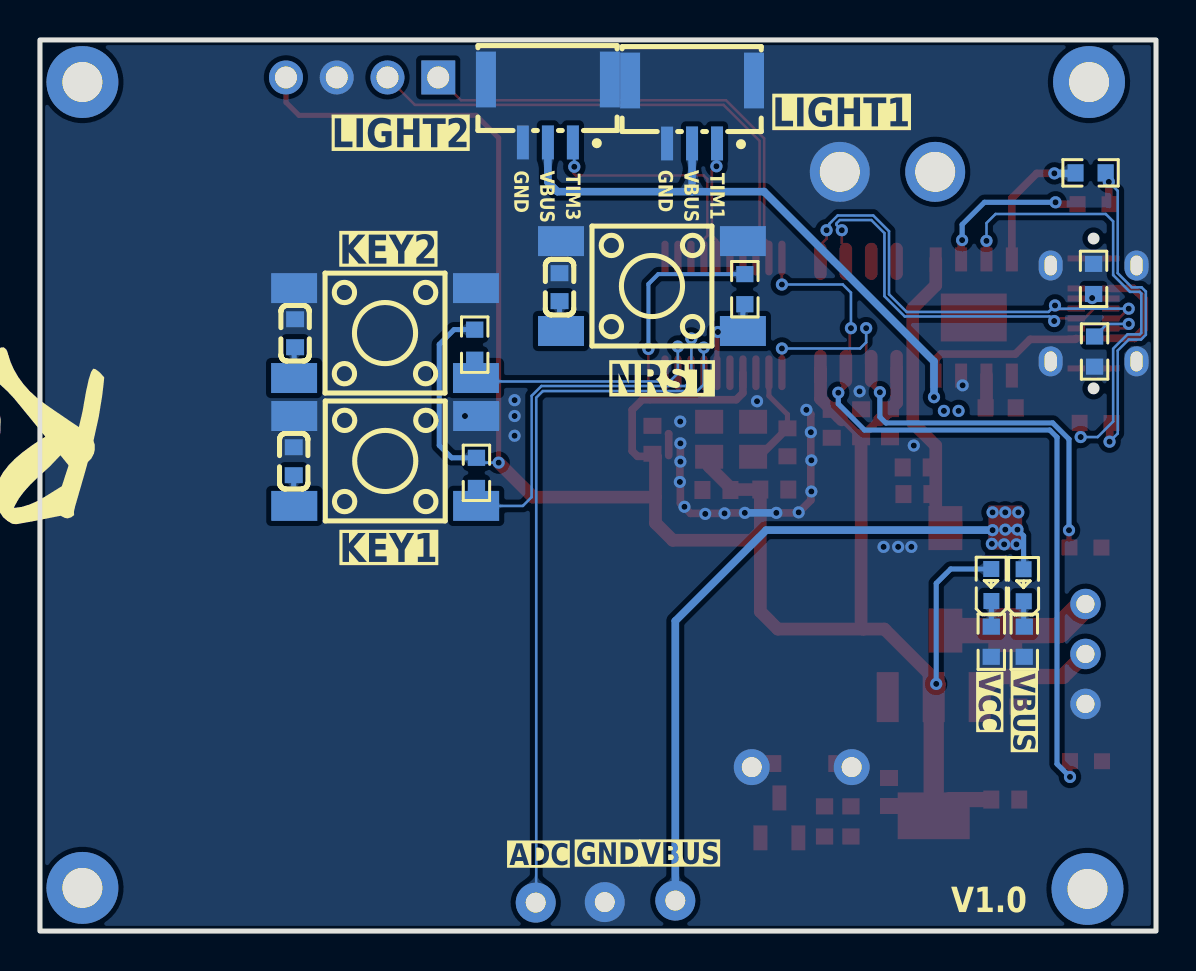
[diagram p5: board, bottom side, seen from below]

Outline 55.84 x 44.6 mm; copper layers: Top Layer, Bottom Layer. Coordinates in mm from the lower left corner of the outline.
Outline path: rectangle 0,44.6 55.84,0
Stack: Top Layer 0.035mm / Dielectric1 1.51mm FR4 er 4.5 / Bottom Layer 0.035mm

## Design rules (mm)
template: 自定义配置
spacing copperThickness1oz (default): track to track 0.102, other pairs 0.152 to 0.3
spacing copperThickness2oz: track to track 0.203, other pairs 0.152 to 0.3
track width copperThickness1oz (default): min 0.127, default 0.127, max 2.54
track width copperThickness2oz: min 0.203, default 0.254, max 2.54
differential pair differentialPair (default): width min 0.127, default 0.254, max 2.54; gap min 0.152, default 0.152
via viaSize (default): diameter min 0.6, default 0.6, max 10; hole min 0.3, default 0.305, max 6.299
net GND uses copperRegion1

## Placement (name value [footprint] x y rotation side)
BUZZER2  3kHz  [BUZ-TH_BD9.6-P5.00-D0.7-FD]  17.73 8.2 0 top
C1  100nF  [C0603]  25.2 24.59 270 top
C2  100nF  [C0603]  11.94 21.87 180 top
C3  10uf  [C0603]  11.98 23.2 180 top
C4  100nF  [C0603]  14.76 25.41 270 top
C5  10uf  [C0603]  13.31 25.41 90 top
C6  100nF  [C0603]  16.23 25.39 270 top
C7  22uf  [C0603]  7.54 6.58 0 top
C8  10uf  [C0603]  6.88 11.94 90 top
C9  100nF  [C0603]  43.15 23.52 270 bottom
C10  100nF  [C0603]  43.08 29.92 270 bottom
C11  100nF  [C0603]  29.85 32.23 270 bottom
C12  10uF  [C0603]  22 22.07 0 top
C13  1000nF  [C0603]  19.1 22.1 180 top
C14  10pF  [C0603]  18.44 24.46 270 top
C53  100nF  [C0603]  13.36 6.96 270 top
CN1  WAFER-GH1.25-3PWB  [CONN-TH_3P-P1.25_GH1.25]  23.22 41 0 bottom
CN2  WAFER-GH1.25-3PWB  [CONN-TH_3P-P1.25_GH1.25]  30.43 41.05 0 bottom
D1  SS14  [SMA_L4.2-W2.6-LS5.3-RD]  10.54 17.6 90 top
D2  SS14  [SMA_L4.2-W2.6-LS5.3-RD]  7.54 17.63 90 top
D3  1N4148W  [SOD-123_L3.1-W1.7-LS3.7-RD]  17.58 8.38 0 top
H1  -  [HDR-TH_4P-P2.54-V-M]  39.73 42.72 0 top
LED1  -  [LED_0603]  2.97 25.43 180 top
LED2  -  [LED_0603]  3.07 36.37 180 top
LED3  -  [LED_0603]  3.58 19.2 0 top
LED4  -  [LED_0603]  3.56 8.51 0 top
LED5  -  [LED_0603]  6.63 17.36 90 bottom
LED6  -  [LED_0603]  8.25 17.37 90 bottom
NOREF  -  [Pad_e63]  11.05 38 0 top
NOREF#2  -  [Pad_e49]  53.72 42.49 0 top
NOREF#3  -  [Pad_e51]  53.72 2.16 0 top
NOREF#4  -  [Pad_e1381]  27.58 1.45 180 top
NOREF#5  -  [Pad_e50]  3.43 2.11 0 top
NOREF#6  -  [Pad_e1379]  31.04 1.42 180 top
NOREF#7  -  [Pad_e65]  15.82 38 0 top
NOREF#8  -  [Pad_e44]  3.35 42.49 0 top
NOREF#9  -  [Pad_e1382]  24.05 1.52 180 top
R1  3.3k  [R0603]  7.77 26.19 180 top
R2  1K  [R0603]  3.28 37.95 180 bottom
R3  5.1k  [R0603]  3.07 29.01 270 bottom
R4  5.1k  [R0603]  3.12 32.64 90 bottom
R5  10K  [R0603]  34 22.93 90 bottom
R6  10K  [R0603]  34.09 29.35 90 bottom
R7  10K  [R0603]  20.58 32.13 90 bottom
R8  3.3k  [R0603]  6.59 14.48 270 bottom
R9  3.3k  [R0603]  8.24 14.48 270 bottom
R58  4.7k  [R0603]  15.27 5.49 90 top
R59  4.7k  [R0603]  16.59 5.49 270 top
SW2  KH-6X6X5H-STM  [SW-SMD_4P-L6.0-W6.0-P4.50-LS9.0-2]  38.57 23.53 0 bottom
SW3  KH-6X6X5H-STM  [SW-SMD_4P-L6.0-W6.0-P4.50-LS9.0-2]  38.58 29.93 0 bottom
SW4  KH-6X6X5H-STM  [SW-SMD_4P-L6.0-W6.0-P4.50-LS9.0-2]  25.22 32.28 0 bottom
U1  STM32G030F6P6  [TSSOP-20_L6.5-W4.4-P0.65-LS6.4-BL]  21.64 30.81 0 top
U3  TP4056-42-ESOP8  [ESOP-8_L4.9-W3.9-P1.27-LS6.0-BL-EP]  9.12 30.71 0 top
U4  CH340N  [SOP-8_L4.9-W3.9-P1.27-LS6.0-BL]  14.88 30.84 180 top
U5  AMS1117-3.3  [SOT-223-3_L6.5-W3.4-P2.30-LS7.0-BR]  11.13 8.74 90 top
U6  SS-12D00-G3  [SW-TH_3P-L8.8-W3.9-P2.50_SS12D00G3]  3.53 13.87 270 top
U7  SS8050  [SOT-23-3_L2.9-W1.3-P1.90-LS2.4-BR]  18.85 5.66 270 top
USB2  TYPEC-303-ACP16  [USB-C-SMD_TYPEC-303-ACP16]  3.12 30.91 90 top
X1  27MHz  [OSC-SMD_4P-L3.2-W2.5-BL]  21.26 24.61 180 top

## Footprints (pads in the part's own frame, mm; a bottom-side part is the same pattern mirrored in y, then rotated)
BUZ-TH_BD9.6-P5.00-D0.7-FD
  round 1.8 hole 1: 1(-2.5,0) 2(2.5,0)
C0603
  rect 0.8x0.9 smd: 1(-0.7,0) 2(0.7,0)
CONN-TH_3P-P1.25_GH1.25
  rect 0.6x1.7 smd: 1(-1.25,1.575) 2(0,1.575) 3(1.25,1.575)
  rect 1x2.8 smd: 4(3.1,-1.575) 5(-3.1,-1.575)
ESOP-8_L4.9-W3.9-P1.27-LS6.0-BL-EP
  rect 0.6x1.2 smd: 1(-1.905,-2.909) 2(-0.635,-2.909) 3(0.635,-2.909) 4(1.905,-2.909) 5(1.905,2.909) 6(0.635,2.909) 7(-0.635,2.909) 8(-1.905,2.909)
  rect 3.3x2.4 smd: 9(0,0)
HDR-TH_4P-P2.54-V-M
  rect 1.7x1.7 hole 1.1: 1(-3.81,0)
  round 1.7 hole 1.1: 2(-1.27,0) 3(1.27,0) 4(3.81,0)
LED_0603
  rect 0.8x0.8 smd: 1(-0.851,-0.01) 2(0.75,-0.005)
OSC-SMD_4P-L3.2-W2.5-BL
  rect 1.4x1.2 smd: 1(-1.1,-0.875) 2(1.1,-0.875) 3(1.1,0.875) 4(-1.1,0.875)
Pad_e44
  round 3.6 hole 2: 1(0,0)
Pad_e49
  round 3.6 hole 2: 1(0,0)
Pad_e50
  round 3.6 hole 2: 1(0,0)
Pad_e51
  round 3.6 hole 2: 1(0,0)
Pad_e63
  round 3 hole 2: 1(0,0)
Pad_e65
  round 3 hole 2: 1(0,0)
Pad_e1379
  round 2 hole 1: 1(0,0)
Pad_e1381
  round 2 hole 1: 1(0,0)
Pad_e1382
  round 2 hole 1: 1(0,0)
R0603
  rect 0.806x0.864 smd: 1(-0.753,0) 2(0.753,0)
SMA_L4.2-W2.6-LS5.3-RD
  rect 2.2x1.7 smd: 1(-2.566,0) 2(2.566,0)
SOD-123_L3.1-W1.7-LS3.7-RD
  rect 0.91x0.84 smd: 1(-1.63,0) 2(1.63,0)
SOP-8_L4.9-W3.9-P1.27-LS6.0-BL
  oval 0.63x1.865 smd: 1(-1.905,-2.683) 2(-0.635,-2.683) 3(0.635,-2.683) 4(1.905,-2.683) 5(1.905,2.683) 6(0.635,2.683) 7(-0.635,2.683) 8(-1.905,2.683)
SOT-23-3_L2.9-W1.3-P1.90-LS2.4-BR
  rect 1.25x0.7 smd: 1(1,-0.95) 2(1,0.95) 3(-1,0)
SOT-223-3_L6.5-W3.4-P2.30-LS7.0-BR
  rect 2.5x1.1 smd: 1(2.97,-2.3) 2(2.97,0) 3(2.97,2.3)
  rect 2.34x3.6 smd: 4(-2.97,0)
SW-SMD_4P-L6.0-W6.0-P4.50-LS9.0-2
  rect 2.3x1.5 smd: 1(-4.55,2.25) 2(4.55,2.25) 3(-4.55,-2.25) 4(4.55,-2.25)
SW-TH_3P-L8.8-W3.9-P2.50_SS12D00G3
  round 1.524 hole 0.914: 1(-2.5,0) 2(0,0) 3(2.5,0)
TSSOP-20_L6.5-W4.4-P0.65-LS6.4-BL
  oval 0.364x1.742 smd: 1(-2.925,-2.871) 2(-2.275,-2.871) 3(-1.625,-2.871) 4(-0.975,-2.871) 5(-0.325,-2.871) 6(0.325,-2.871) 7(0.975,-2.871) 8(1.625,-2.871) 9(2.275,-2.871) 10(2.925,-2.871) 11(2.925,2.871) 12(2.275,2.871) 13(1.625,2.871) 14(0.975,2.871) 15(0.325,2.871) 16(-0.325,2.871) 17(-0.975,2.871) 18(-1.625,2.871) 19(-2.275,2.871) 20(-2.925,2.871)
USB-C-SMD_TYPEC-303-ACP16
  oval 1.5x1.2 hole 1x0.61: 1(-2.4,2.15) 2(-2.4,-2.15) 3(2.4,2.15) 4(2.4,-2.15)
  rect 0.3x0.87 smd: A1(-2.75,0.865) A4(-1.25,0.865) A5(-0.75,0.865) A6(-0.25,0.865) A7(0.25,0.865) A8(0.75,0.865) A9(1.25,0.865) A12(2.75,0.865) B1(2.75,-0.865) B4(1.25,-0.865) B5(0.75,-0.865) B6(0.25,-0.865) B7(-0.25,-0.865) B8(-0.75,-0.865) B9(-1.25,-0.865) B12(-2.75,-0.865)

## Nets
As in the schematic, except:
GND: C1.1 C2.1 C3.1 C4.1 C5.1 C6.2 C7.1 C8.1 C9.1 C10.1 C11.1 C12.2 C13.2 C53.2 CN1.3 CN1.4 CN1.5 CN2.3 CN2.4 CN2.5 H1.3 LED3.1 LED4.1 NOREF#4.1 NOREF#7.1 R1.2 R3.2 R4.2 R8.2 R9.2 R59.1 SW2.3 SW2.4 SW3.3 SW3.4 SW4.3 SW4.4 U1.5 U3.1 U3.3 U4.3 U5.1 U6.3 U7.2 USB2.1 USB2.2 USB2.3 USB2.4 USB2.A1 USB2.B12 X1.2
VBUS: BUZZER2.1 C53.1 CN1.2 CN2.2 D2.2 D3.1 LED5.2 NOREF#9.1 R2.1 U3.4 U3.8 USB2.A4 USB2.A9 USB2.B4 USB2.B9
ADC: NOREF#6.1 U1.7
BAT: C2.2 C3.2 D1.2 NOREF.1 U3.5

Pads without a net: C14 2; NOREF#2 1; NOREF#3 1; NOREF#5 1; NOREF#8 1; U1 3 10 11 12 16 17; U3 9; U4 4; USB2 A8 A12 B1 B8; X1 1

## Via types
v1: diameter 0.61, hole 0.305, Top Layer to Bottom Layer, 68 vias

## Routing (per net, layer and track width the routed paths; a pad name or vN(x,y) marks a point on that pad's centre or on a via; arc(x,y) is an arc through that point)
GND: length 15.6
  Top Layer w0.381: v1(23.83,22.48) 23.83,23.47 v1(23.8,23.5) v1(23.8,24.41) ; v1(20.58,20.93) 21.56,20.93 v1(21.59,20.9) 23.29,20.9 23.8,21.41 23.8,22.3 ; 17.27,22.03 17.27,23.59 ; 17.27,22.03 17.27,21.56 v1(17.88,20.95) 17.91,20.93 v1(19,20.93) ; 17.27,22.03 v1(17.25,22) ; 17.27,23.59 v1(17.27,24.97) 17.27,25.86 v1(17.5,26.09) ; 17.27,23.59 v1(17.25,23.56) ; 24.38,23.8 24.38,24.88 24.39,24.89
  Bottom Layer w0.381: v1(19,20.93) v1(20.58,20.93)
  vias: v1(9.68,27.31) v1(12.12,24.3) v1(12.24,19.23) v1(12.9,19.23) v1(13.63,19.23) v1(14.83,27.01) v1(19.96,26.52) v1(22.55,20.88) v1(23.6,21.23) v1(23.81,25.5) v1(32.1,26.57) v1(32.1,25.78) v1(32.1,24.79) v1(34.58,25.78)
VBUS: length 84
  Top Layer w0.381: USB2.B9 4.03,29.62 6.3,29.62 7.04,28.88 10.77,28.88 11.02,28.63 U3.4 ; USB2.A9 1.12,32.16 0.58,31.62 0.58,30.15 1.07,29.66 USB2.A4 ; v1(5.09,37.92) 5.97,37.92 7.21,36.68 U3.8
  Bottom Layer w0.254: v1(7.54,20.09) v1(6.93,20.09) 6.62,19.78 LED5.2
  Bottom Layer w0.381: v1(11.11,26.72) 11.11,28.51 19.61,37.01 23.22,37.01 ; v1(5.09,37.92) 4.06,37.92 R2.1 ; NOREF#9.1 24.05,15.52 19.51,20.07 v1(8.18,20.07) ; CN2.2 30.43,37.49 29.95,37.01 23.22,37.01 ; 23.22,37.01 CN1.2
  vias: v1(6.89,20.96) v1(6.98,19.36) v1(7.54,20.96) v1(7.6,19.36) v1(8.18,20.96) v1(8.21,19.38) v1(9.88,26.03) v1(10.61,26.03)
VCC: length 134
  Top Layer w0.127: v1(25.4,29.13) 25.4,26.67 25.33,26.59
  Top Layer w0.254: v1(32.89,23.44) 32.89,39.7 34.02,40.83 42.88,40.83 43.54,41.48 H1.4
  Top Layer w0.381: 15.73,25.58 15.63,25.58 C4.2 13.89,25.58 13.84,25.58 ; C1.2 25.33,23.76 25.94,23.76 26.21,24.03 26.21,26.09 25.7,26.59 21.01,26.59 20.67,26.93 U1.4
  Top Layer w0.635: 25.04,21.72 25.04,23.73 C1.2 ; 25.04,21.72 25.04,20.42 24.18,19.56 20.24,19.56 19.8,19.99 ; 25.04,21.72 31.17,21.72 v1(32.89,23.44) ; 12.98,28.15 12.98,26.44 C5.2 13.84,25.58 ; 10.85,12.14 10.85,12.37 13.59,15.11 14.65,15.11 ; 19.8,19.99 C13.1 21.27,22.1 C12.1 21.3,22.19 22.36,23.25 22.36,23.74 ; 19.8,19.99 19.8,15.99 18.92,15.11 14.65,15.11 ; 14.65,15.11 14.76,15.22 C4.2 ; U4.8 16.79,26.65 C6.1 15.73,25.58
  Top Layer w0.762: C7.2 10.31,6.58 U5.4
  Top Layer w1.016: U5.2 U5.4
  Bottom Layer w0.127: R5.2 33.76,23.44 v1(32.89,23.44)
  Bottom Layer w0.203: v1(25.4,29.13) 25.4,32.39 24.91,32.88 R7.2
  Bottom Layer w0.254: R5.2 35.24,23.69 35.86,24.31 35.86,29.36 35.13,30.1 R6.2 ; v1(11,12.37) 11,17.4 10.28,18.12 LED6.2
VIN: length 5.7
  Top Layer w0.762: 8.5,12.19 7.95,12.74 4.66,12.74 U6.2
ADC: length 37.3
  Top Layer w0.127: v1(22.63,29.2) 22.63,27.96 U1.7
  Bottom Layer w0.127: v1(22.63,29.2) 22.63,27.36 22.96,27.03 30.68,27.03 31.01,26.7 31.01,1.17
BAT: length 14.7
  Top Layer w0.635: D1.2 10.74,20.17 11.02,20.45 11.02,24.3 12.17,25.45 12.17,31.17 11.02,32.32 U3.5
KEY1: length 20.2
  Top Layer w0.127: v1(23.25,29.66) 23.25,27.96 U1.8
  Bottom Layer w0.127: SW2.1 31.68,21.28 31.24,21.72 31.24,26.79 30.75,27.28 23.55,27.28 23.25,27.57 v1(23.25,29.66)
KEY2: length 13
  Top Layer w0.127: v1(23.93,29.26) 23.93,27.95 U1.9
  Bottom Layer w0.127: v1(23.93,29.26) 23.93,27.91 24.33,27.51 33.86,27.51 SW3.1
NRST: length 4.7
  Top Layer w0.254: U1.6 21.97,29.94 v1(21.92,29.98)
  Bottom Layer w0.254: v1(21.92,29.98) 20.72,29.98 SW4.1 20.67,31.28 R7.1
OSCIN: length 5.5
  Top Layer w0.254: C14.1 18.44,25.86 19.37,26.79 U1.2
  Top Layer w0.381: X1.3 19.86,23.74 C14.1
RX: length 26.4
  Top Layer w0.127: v1(14.5,30.17) 14.5,28.41 U4.6 ; v1(18.72,29.16) U1.1
  Top Layer w0.254: U4.6 14.25,27.4 v1(13.82,26.97) ; LED3.2 4.35,19.22 v1(4.35,20.06)
  Bottom Layer w0.127: v1(18.72,29.16) 14.81,29.16 14.5,29.46 v1(14.5,30.17)
  Bottom Layer w0.254: v1(4.35,20.06) 4.35,24.62 5.17,25.43 13.52,25.43 13.82,25.73 v1(13.82,26.97)
SWCLK: length 23.7
  Top Layer w0.127: U1.19 19.37,34.43 19.61,34.67 19.61,39.67 21.51,41.58 34.77,41.58 H1.1
SWDIO: length 25.9
  Top Layer w0.127: U1.18 20.02,34.51 19.84,34.7 19.84,39.55 21.64,41.35 37.08,41.35 38.46,42.72
TIM1: length 5.9
  Top Layer w0.127: U1.15 21.97,34.57 22.22,34.82 22.22,38.05 v1(22,38.28)
  Bottom Layer w0.127: CN1.1 22,39.39 v1(22,38.28)
TIM3: length 12
  Top Layer w0.127: v1(29.11,38.25) 29.16,38.2 29.16,37.94 29.03,37.82 22.63,37.82 22.45,37.64 22.45,34.8 22.62,34.63 U1.14
  Bottom Layer w0.127: v1(29.11,38.25) 29.11,39.06 29.13,39.09
TX: length 40.5
  Top Layer w0.127: U1.20 v1(18.72,32.36) ; 15.52,28.15 15.32,28.36 15.32,30.12 v1(15.27,30.17)
  Top Layer w0.254: 15.52,28.15 15.52,27.32 v1(15.9,26.94) ; LED4.2 v1(4.31,7.71)
  Bottom Layer w0.127: v1(18.72,32.36) 15.67,32.36 15.27,31.95 v1(15.27,30.17)
  Bottom Layer w0.254: v1(4.31,7.71) 4.95,8.36 4.95,24.71 5.31,25.08 14.58,25.08 15.9,26.39 v1(15.9,26.94)
USB_D+: length 23.5
  Top Layer w0.127: USB2.B6 4.03,31.12 4.86,31.12 v1(5.05,31.31) ; U4.1 16.79,34.34 16.48,34.65 v1(16.48,35.08) ; USB2.A6 1.87,30.66 1.38,31.15 v1(1.37,31.15)
  Bottom Layer w0.127: v1(16.48,35.08) 16.35,35.22 16.35,35.4 15.93,35.81 14.15,35.81 13.36,35.03 13.36,31.87 12.48,30.99 5.38,30.99 v1(5.05,31.31) 4.89,31.15 v1(1.37,31.15)
USB_D-: length 20.1
  Top Layer w0.127: v1(5.1,30.53) 4.97,30.66 USB2.B7 3.58,30.66 3.08,31.16 USB2.A7 ; 15.52,33.52 15.57,33.57 15.57,34.29 15.72,34.44 v1(15.72,35.08)
  Bottom Layer w0.127: v1(15.72,35.08) 15.99,35.34 15.99,35.42 15.82,35.59 14.24,35.59 13.59,34.93 13.59,31.78 12.57,30.76 5.32,30.76 v1(5.1,30.53)
VOUT: length 7.6
  Top Layer w1.27: 7.57,15.04 D2.1 ; 7.57,15.04 D1.1 ; 7.57,15.04 4.86,15.04 U6.1
$1N907: length 1.6
  Top Layer w0.635: 8.53,26.19 8.48,26.23 8.48,27.8
$1N910: length 17.4
  Top Layer w0.381: v1(2.33,24.49) 2.33,25.43 2.4,25.51 ; v1(2.36,37.5) 2.36,36.71 2.26,36.62 2.48,36.4
  Bottom Layer w0.127: v1(2.36,37.5) 1.92,37.05 1.92,32.93 1.21,32.22 0.72,32.22 0.51,32 0.51,29.84 0.75,29.6 1.36,29.6 1.92,29.05 1.92,24.9 v1(2.33,24.49)
$1N911: length 23
  Top Layer w0.381: v1(8.48,34.54) 8.48,33.62 ; LED1.1 3.77,25.38 v1(3.77,24.73)
  Bottom Layer w0.127: v1(3.77,24.73) 2.92,24.73 2.15,25.5 2.15,29.15 1.43,29.87 0.81,29.87 0.74,29.94 0.74,31.91 0.82,31.99 1.3,31.99 2.15,32.83 2.15,35.52 2.51,35.89 8.03,35.89 8.48,35.43 v1(8.48,34.54)
$1N912: length 8
  Top Layer w0.381: LED2.1 4.94,36.38 v1(5.03,36.47) ; v1(9.7,34.58) 9.75,34.53 U3.6
  Bottom Layer w0.254: v1(5.03,36.47) 8.59,36.47 9.7,35.36 v1(9.7,34.58)
$1N1730: length 3.1
  Top Layer w0.127: v1(1.37,30.39) 1.37,30.18 1.39,30.16 USB2.A5
  Bottom Layer w0.127: R3.1 2.45,30.39 v1(1.37,30.39)
$1N1756: length 0.8
  Top Layer w0.127: v1(3.2,31.68) 3.97,31.68 USB2.B5
$1N2680: length 1.6
  Bottom Layer w0.254: SW2.2 43.15,21.31 C9.2
$1N2872: length 1.6
  Bottom Layer w0.254: 43.13,27.68 43.13,29.17 C10.2
$1N3022: length 1.5
  Bottom Layer w0.254: SW4.2 29.85,30.11 C11.2
$1N3734: length 1.3
  Bottom Layer w0.254: 6.59,15.23 6.62,15.26 LED5.1
$1N3739: length 1.3
  Bottom Layer w0.254: 8.24,15.23 8.24,15.24 LED6.1

## Copper pours and planes (outline as drawn; the poured copper is in the pictures)
GND on Top Layer: -3.2,47.68 64.39,47.68 64.39,-9.6 -3.2,-9.6
GND on Bottom Layer: -4.98,51.46 64.14,51.46 64.14,-24.18 -4.98,-24.18
VBUS on Top Layer: 6.45,28.55 11.56,28.55 11.56,18.85 6.45,18.85
VBUS on Top Layer: 4.34,34.37 7.55,34.37 7.55,31.98 4.34,31.98
BAT on Top Layer: 9.75,37.21 12.34,37.21 12.34,33.02 9.75,33.02

Small or netless copper shapes (teardrops, artwork), in the pictures only: 56 on Top Layer, 29 on Bottom Layer

## Text on the board
Bottom Silkscreen Layer: TIM1 | VBUS | GND | TIM3 | VCC | ADC | V1.0 | LIGHT1 | NRST | KEY1 | KEY2 | LIGHT2
Top Silkscreen Layer: STDBY | CHRG | RX | TX | CLK | DIO | GND | 3V3 | By xy in LionHeart | BAT
